# Altium schematic sheet 04 MAIN POWER.SchDoc
size A2; ApprovedBy: DNP; CheckedBy: DNP; Author: DNP; CompanyName: Google LLC; DrawnBy: DNP; Organization: Google LLC; Address1: 1600 Amphitheatre Parkway; Address2: Mountain View, CA 94043; Address3: DNP; Address4: DNP; DocumentNumber: 4; SheetNumber: 4; SheetTotal: 17; VersionControl_RevNumber: DNP; IsUserConfigurable: DNP; Time: DNP; ImagePath: DNP; Rule: DNP; ProjectName: Enterprise; Application_BuildNumber: DNP
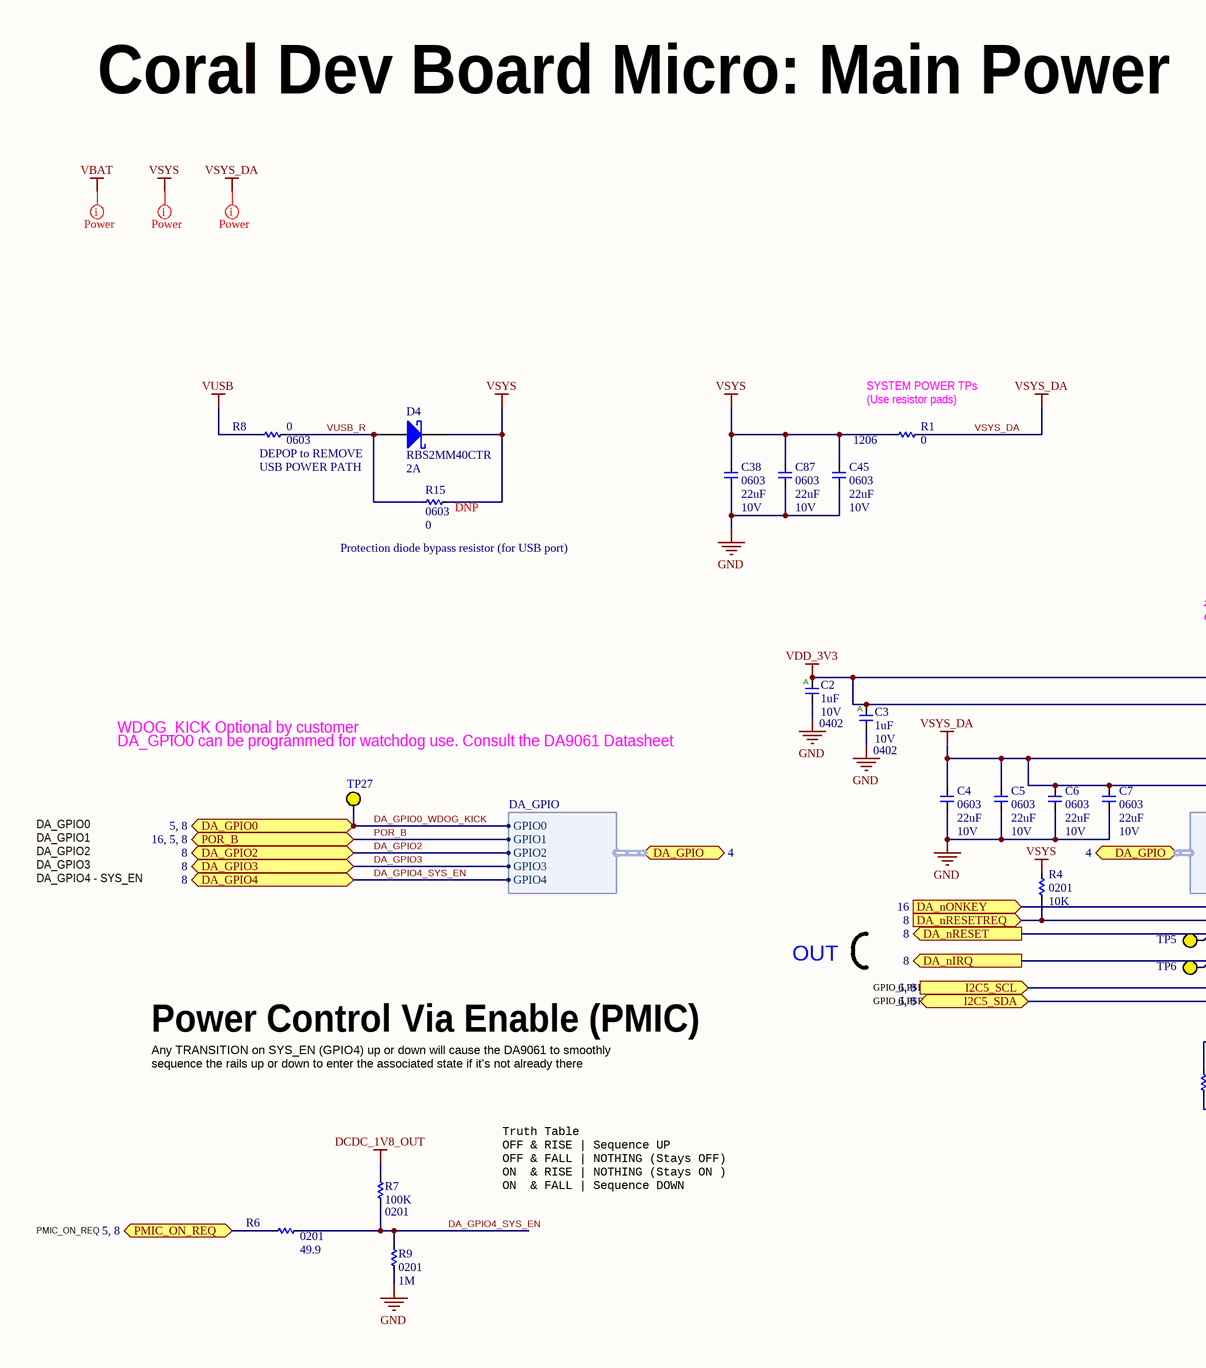
[diagram p0: 04 MAIN POWER.SchDoc, left]
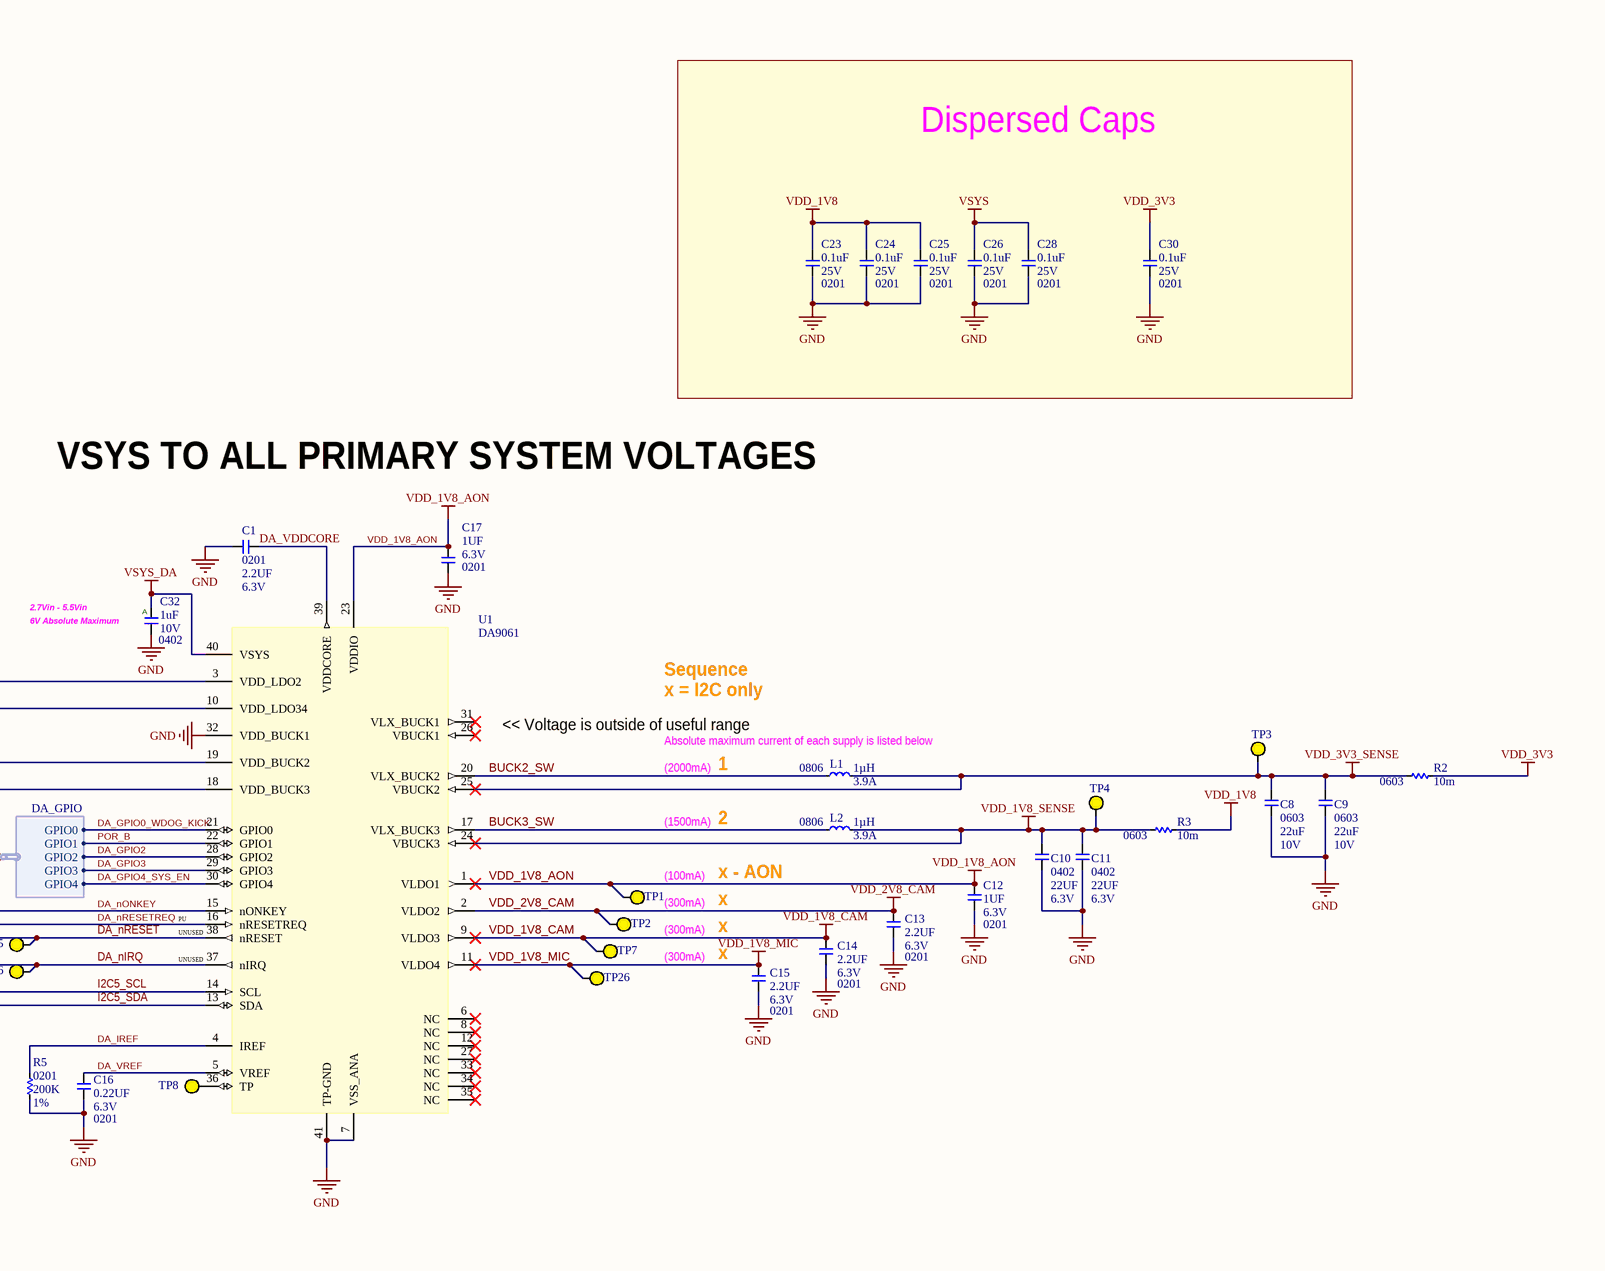
[diagram p1: 04 MAIN POWER.SchDoc, right]

## Parts
C1  value 2.2UF  Package: 0201  Voltage: 6.3V  [C0201_H0.39MM]  (hidden comment: __Template_Cap)
C2  value 1uF  Package: 0402  Voltage: 10V  [C0402]  (hidden comment: __Template_Cap_Auto)
C3  value 1uF  Package: 0402  Voltage: 10V  [C0402]  (hidden comment: __Template_Cap_Auto)
C4  value 22uF  Package: 0603  Voltage: 10V  [C0603]  (hidden comment: __Template_Cap)
C5  value 22uF  Package: 0603  Voltage: 10V  [C0603]  (hidden comment: __Template_Cap)
C6  value 22uF  Package: 0603  Voltage: 10V  [C0603]  (hidden comment: __Template_Cap)
C7  value 22uF  Package: 0603  Voltage: 10V  [C0603]  (hidden comment: __Template_Cap)
C8  value 22uF  Package: 0603  Voltage: 10V  [C0603]  (hidden comment: __Template_Cap)
C9  value 22uF  Package: 0603  Voltage: 10V  [C0603]  (hidden comment: __Template_Cap)
C10  value 22UF  Package: 0402  Voltage: 6.3V  [C0402]  (hidden comment: __Template_Cap)
C11  value 22UF  Package: 0402  Voltage: 6.3V  [C0402]  (hidden comment: __Template_Cap)
C12  value 1UF  Package: 0201  Voltage: 6.3V  [C0201_H0.39MM]  (hidden comment: __Template_Cap)
C13  value 2.2UF  Package: 0201  Voltage: 6.3V  [C0201_H0.39MM]  (hidden comment: __Template_Cap)
C14  value 2.2UF  Package: 0201  Voltage: 6.3V  [C0201_H0.39MM]  (hidden comment: __Template_Cap)
C15  value 2.2UF  Package: 0201  Voltage: 6.3V  [C0201_H0.39MM]  (hidden comment: __Template_Cap)
C16  value 0.22UF  Package: 0201  Voltage: 6.3V  [C0201]  (hidden comment: __Template_Cap)
C17  value 1UF  Package: 0201  Voltage: 6.3V  [C0201_H0.39MM]  (hidden comment: __Template_Cap)
C23  value 0.1uF  Package: 0201  Voltage: 25V  [C0201Y]  (hidden comment: __Template_Cap)
C24  value 0.1uF  Package: 0201  Voltage: 25V  [C0201Y]  (hidden comment: __Template_Cap)
C25  value 0.1uF  Package: 0201  Voltage: 25V  [C0201Y]  (hidden comment: __Template_Cap)
C26  value 0.1uF  Package: 0201  Voltage: 25V  [C0201Y]  (hidden comment: __Template_Cap)
C28  value 0.1uF  Package: 0201  Voltage: 25V  [C0201Y]  (hidden comment: __Template_Cap)
C30  value 0.1uF  Package: 0201  Voltage: 25V  [C0201Y]  (hidden comment: __Template_Cap)
C32  value 1uF  Package: 0402  Voltage: 10V  [C0402]  (hidden comment: __Template_Cap_Auto)
C38  value 22uF  Package: 0603  Voltage: 10V  [C0603]  (hidden comment: __Template_Cap)
C45  value 22uF  Package: 0603  Voltage: 10V  [C0603]  (hidden comment: __Template_Cap)
C87  value 22uF  Package: 0603  Voltage: 10V  [C0603]  (hidden comment: __Template_Cap)
D4  value RBS2MM40CTR  Current - Average Rectified (IO): 2A  [SOD123_AK]  (hidden comment: __Template_DIODE_SCHOTTKY)
L1  value 1µH  Package: 0806  Isat: 3.9A  [L2016_H1.0MM]  (hidden comment: __Template_Inductor)
L2  value 1µH  Package: 0806  Isat: 3.9A  [L2016_H1.0MM]  (hidden comment: __Template_Inductor)
R1  value 0  Package: 1206  [R1206]
R2  value 10m  Package: 0603  [R0603]
R3  value 10m  Package: 0603  [R0603]
R4  value 10K  Package: 0201  [R0201]
R5  value 200K  Package: 0201  Tolerance: 1%  [R0201]
R6  value 49.9  Package: 0201  [R0201]
R7  value 100K  Package: 0201  [R0201]
R8  value 0  Package: 0603  [R0603]
R9  value 1M  Package: 0201  [R0201]
R15  value 0  Package: 0603  [R0603]
TP1  TESTPAD_30MIL  [TESTPAD_SMT_30MIL]  (value not drawn)  (no BOM)
TP2  TESTPAD_30MIL  [TESTPAD_SMT_30MIL]  (value not drawn)  (no BOM)
TP3  TESTPAD_30MIL  [TESTPAD_SMT_30MIL]  (value not drawn)  (no BOM)
TP4  TESTPAD_30MIL  [TESTPAD_SMT_30MIL]  (value not drawn)  (no BOM)
TP5  TESTPAD_30MIL  [TESTPAD_SMT_30MIL]  (value not drawn)  (no BOM)
TP6  TESTPAD_30MIL  [TESTPAD_SMT_30MIL]  (value not drawn)  (no BOM)
TP7  TESTPAD_30MIL  [TESTPAD_SMT_30MIL]  (value not drawn)  (no BOM)
TP8  TESTPAD_30MIL  [TESTPAD_SMT_30MIL]  (value not drawn)  (no BOM)
TP26  TESTPAD_30MIL  [TESTPAD_SMT_30MIL]  (value not drawn)  (no BOM)
TP27  TESTPAD_30MIL  [TESTPAD_SMT_30MIL]  (value not drawn)  (no BOM)
U1  MFG P/N: DA9061  [QFN50P600X600X90-40-TP]  (hidden comment: PMIC_DIALOG_SEMI_DA9061)

## Blocks framed on the sheet
Dispersed Caps: C23-C26 C28 C30

## Ports
DA_GPIO0 (bidir, see 5, 8), DA_GPIO2 (bidir, see 8), DA_GPIO3 (bidir, see 8), DA_GPIO4 (bidir, see 8), DA_GPIO (bidir, harness DA_GPIO, see 4), DA_nIRQ (out, see 8), DA_nONKEY (in, see 16), DA_nRESET (out, see 8), DA_nRESETREQ (in, see 8), I2C5_SCL (in, see 6, 8), I2C5_SDA (bidir, see 6, 8), PMIC_ON_REQ (bidir, see 5, 8), POR_B (bidir, see 16, 5, 8)

## Harnesses
DA_GPIO: GPIO0, GPIO1, GPIO2, GPIO3, GPIO4

## Nets
DCDC_1V8_OUT: R7.2
GND: C1.1 C2.2 C3.2 C4.2 C5.2 C6.2 C7.2 C8.2 C9.2 C10.2 C11.2 C12.2 C13.2 C14.2 C15.2 C16.2 C17.2 C23.2 C24.2 C25.2 C26.2 C28.2 C30.2 C32.2 C38.2 C45.2 C87.2 R5.1 R9.1 U1.7(VSS_ANA) U1.32(VDD_BUCK1) U1.41(TP-GND)
VDD_1V8: C23.1 C24.1 C25.1 R3.2
VDD_1V8_AON: C12.1 C17.1 TP1.1 U1.1(VLDO1) U1.23(VDDIO)
VDD_1V8_CAM: C14.1 TP7.1 U1.9(VLDO3)
VDD_1V8_MIC: C15.1 TP26.1 U1.11(VLDO4)
VDD_1V8_SENSE: C10.1 C11.1 L2.2 R3.1 TP4.1 U1.24(VBUCK3)
VDD_2V8_CAM: C13.1 TP2.1 U1.2(VLDO2)
VDD_3V3: C2.1 C3.1 C30.1 R2.2 U1.3(VDD_LDO2) U1.10(VDD_LDO34)
VDD_3V3_SENSE: C8.1 C9.1 L1.2 R2.1 TP3.1 U1.25(VBUCK2)
VSYS: C26.1 C28.1 C38.1 C45.1 C87.1 D4.K R1.1 R4.2 R15.1
VSYS_DA: C4.1 C5.1 C6.1 C7.1 C32.1 R1.2 U1.18(VDD_BUCK3) U1.19(VDD_BUCK2) U1.40(VSYS)
VUSB: R8.2
BUCK2_SW: L1.1 U1.20(VLX_BUCK2)
BUCK3_SW: L2.1 U1.17(VLX_BUCK3)
DA_GPIO0_WDOG_KICK: TP27.1 U1.21(GPIO0) ; port DA_GPIO0, port DA_GPIO.GPIO0
DA_GPIO2: U1.28(GPIO2) ; port DA_GPIO2, port DA_GPIO.GPIO2
DA_GPIO3: U1.29(GPIO3) ; port DA_GPIO3, port DA_GPIO.GPIO3
DA_GPIO4_SYS_EN: R6.2 R7.1 R9.2 U1.30(GPIO4) ; port DA_GPIO4, port DA_GPIO.GPIO4
DA_IREF: R5.2 U1.4(IREF)
DA_nIRQ: TP6.1 U1.37(nIRQ) ; port DA_nIRQ
DA_nONKEY: U1.15(nONKEY) ; port DA_nONKEY
DA_nRESET: TP5.1 U1.38(nRESET) ; port DA_nRESET
DA_nRESETREQ: R4.1 U1.16(nRESETREQ) ; port DA_nRESETREQ
DA_VDDCORE: C1.2 U1.39(VDDCORE)
DA_VREF: C16.1 U1.5(VREF)
I2C5_SCL: U1.14(SCL) ; port I2C5_SCL
I2C5_SDA: U1.13(SDA) ; port I2C5_SDA
PMIC_ON_REQ: R6.1 ; port PMIC_ON_REQ
POR_B: U1.22(GPIO1) ; port POR_B, port DA_GPIO.GPIO1
VUSB_R: D4.A R8.1 R15.2
NetTP8_1: TP8.1 U1.36(TP)

Not connected (* = marked no-connect by the designer): U1 6(NC)* 8(NC)* 12(NC)* 26(VBUCK1)* 27(NC)* 31(VLX_BUCK1)* 33(NC)* 34(NC)* 35(NC)*

## Layout directives
net class Power: VBAT, VSYS, VSYS_DA

## Notes on the sheet
- Coral Dev Board Micro: Main Power
- (near R1) SYSTEM POWER TPs
- (near R8) DEPOP to REMOVE
- (near R1) (Use resistor pads)
- (near R8) USB POWER PATH
- VSYS TO ALL PRIMARY SYSTEM VOLTAGES
- (near R15) Protection diode bypass resistor (for USB port)
- 2.7Vin - 5.5Vin
- (near C32) 6V Absolute Maximum
- WDOG_KICK Optional by customer
- << Voltage is outside of useful range
- Sequence
- x = I2C only
- DA_GPIO0 can be programmed for watchdog use. Consult the DA9061 Datasheet
- (2000mA)
- (near L1) Absolute maximum current of each supply is listed below
- 1
- DA_GPIO2
- DA_GPIO3
- DA_GPIO1
- DA_GPIO0
- (1500mA)
- 2
- DA_GPIO4 - SYS_EN
- (near U1) PU
- (near U1) UNUSED
- (near TP1) (100mA)
- (300mA)
- x - AON
- x
- (near C15) x
- OUT
- GPIO_LPSR_04
- GPIO_LPSR_05
- Power Control Via Enable (PMIC)
- Any TRANSITION on SYS_EN (GPIO4) up or down will cause the DA9061 to smoothly sequence the rails up or down to enter the associated state if it's not already there
- Truth Table
  OFF & RISE | Sequence UP
  OFF & FALL | NOTHING (Stays OFF)
  ON  & RISE | NOTHING (Stays ON )
  ON  & FALL | Sequence DOWN
- PMIC_ON_REQ
- Labels drawn without touching a wire or pin: VBAT, VSYS, VSYS_DA
- Project:
- Engineer:
- Date:
- File:
- Revision:
- Sheet
- of
- (in symbol 26) A

## Library data of the parts
C1 C13-C15 = 1761: CAP, CER, X5R, 2.2uF, 20%, 6.3V, 0201, 0.39mm; ID: 1761; MFG: YAGEO; MFG P/N: CC0201MRX5R5BB225; EPIC: G150-01316-00; Status: In Development; Dielectric: X5R; Tolerance: 20%; Height: 0.39mm; Supplier 1: Digi-Key; HelpURL: https://www.digikey.com/product-detail/en/yageo/CC0201MRX5R5BB225/311-3473-1-ND/7164494; ComponentLink1Description: Datasheet; ComponentLink1URL: http://www.yageo.com/documents/recent/UPY-GPHC_X5R_4V-to-50V_25.pdf; Supplier Part Number 1: 311-3473-1-ND
C2 C3 C32 = 26: CAP, CER, X5R, 1uF, 10V, 10%, 0402, AUTOGRADE; ID: 26; MFG: Taiyo Yuden; MFG P/N: LMK105BJ105KVHF; XPN: 150-01126-00; PROXY: Use ID #574; Gecko: 150-04432-00; Status: Released; Dielectric: X5R; Tolerance: 10%; Height: 0.55mm; Supplier 1: Digi-Key; ComponentLink1Description: Datasheet; COMMON: 150-01126-00; Supplier Part Number 1: 587-3712-1-ND
C4-C9 C38 C45 C87 = 108: CAP, CER, X5R, 22uF, 20%, 10V, 0603; ID: 108; MFG: TDK; MFG P/N: C1608X5R1A226M080AC; XPN: 150-00202-00; PROXY: Use ID #452; Status: Released; Dielectric: X5R; Tolerance: 20%; Height: 1mm; ComponentLink1Description: Datasheet; COMMON: 150-00202-00
C10 C11 = 1719: CAP, CER, X5R, 22uF, 20%, 6.3V, 0402; ID: 1719; MFG: AVX; MFG P/N: 04026D226MAT2A; XPN: 150-00420-00; PROXY: 150-03491-00; Status: Released; Dielectric: X5R; Tolerance: 20%; Height: 0.70mm; Supplier 1: Digi-Key; HelpURL: https://www.digikey.in/product-detail/en/avx-corporation/04026D226MAT2A/478-9839-1-ND/5964924; ComponentLink1Description: Datasheet; ComponentLink1URL: http://datasheets.avx.com/cx5r.pdf; COMMON: 150-00420-00; LOON: 150-00420-00; Gecko: 150-00420-00; Supplier Part Number 1: 478-9839-1-ND
C12 C17 = 1771: CAP, CER, X6S, 1uF, 20%, 6.3V, 0201, 0.39mm; ID: 1771; MFG: MURATA; MFG P/N: GRM033C80J105ME05D; EPIC: G150-02531-00; Status: In Development; Dielectric: X6S; Tolerance: 20%; Height: 0.39mm; Supplier 1: Digi-Key; HelpURL: https://www.digikey.com/product-detail/en/murata-electronics-north-america/GRM033C80J105ME05D/490-13218-1-ND/5877426; ComponentLink1Description: Datasheet; ComponentLink1URL: https://psearch.en.murata.com/capacitor/product/GRM033C80J105ME05%23.pdf; Supplier Part Number 1: 490-13218-1-ND
C16 = 983: CAP, CER, X5R, 0.22uF, 6.3V, 10%, 0201, 0.33mm T; ID: 983; MFG: TDK; MFG P/N: C0603X5R0J224K030BB; XPN: 150-00425-00; Status: NRND; Dielectric: X5R; Tolerance: 10%; Height: 0.33mm T; ComponentLink1Description: Datasheet; COMMON: 150-00425-00
C23-C26 C28 C30 = 386: CAP, CER, X5R, 0.1uF, 25V, 20%, 0201, 0.33mm T; ID: 386; MFG: MURATA; MFG P/N: GRM033R61E104ME14D; XPN: 150-01204-00; Status: Released; Dielectric: X5R; Tolerance: 20%; Height: 0.33mm T; ComponentLink1Description: Datasheet; COMMON: 150-01204-00; LOON: 150-01204-00; Gecko: 150-01204-00
D4 = 348: DIODE, SCHOTTKY, 20V VRRM, 2A IO, 45A SURGE, SOD-123F; ID: 348; MFG: Rohm Semiconductor; Voltage – Forward (VF) (MAX) @ IF: 390 mV @ 2 A; Current - Reverse Leakage @ VR: 600 µA @ 20 V; Status: Released; MFG P/N: RBS2MM40CTR; Package: SOD-123F; Category: DIODE; RoHS Compliant: Yes; Diode Type: Schottky; Mounting Type: SMD; Voltage - DC Reverse (VR) (MAX): 20V; Operating Temperature – Junction: 125°C; Supplier 1: Digi-Key; HelpURL: https://www.digikey.com/en/products/detail/rohm-semiconductor/RBS2MM40CTR/13547997?s=N4IgTCBcDaIEoCEDKYCyqAsAGAwgFThAF0BfIA; ComponentLink1Description: Datasheet; ComponentLink1URL: https://fscdn.rohm.com/en/products/databook/datasheet/discrete/diode/schottky_barrier/rbs2mm40ctr-e.pdf; Height: 0.9mm; Supplier Part Number 1: 846-RBS2MM40CTR-ND
L1 L2 = 881: IND, PWR, FILM, 1uH, 20%, 3.9A Isat, 3.1A Idc, 0.056 DCR, 2016m, 1.00mm; ID: 881; Catagory: Fixed Inductors; MFG: TDK; MFG P/N: TFM201610ALM-1R0MTAA; Tolerance: 20; L Test Freq: 1MHz; Rdc max: 56mOhm Max; EPIC: G180-01867-00; ComponentLink1Description: Datasheet; Status: In Development; Supplier 1: Digi-Key; HelpURL: https://www.digikey.com/product-detail/en/tdk-corporation/TFM201610ALM-1R0MTAA/445-174185-1-ND/5812325; ComponentLink1URL: https://product.tdk.com/info/en/catalog/datasheets/inductor_commercial_power_tfm201610alm_en.pdf; Supplier Part Number 1: 445-174185-1-ND
R1 = 5: RES, 0, 5%, 1/4W, 1206; ID: 5; MFG: ROHM; MFG P/N: MCR18EZHJ000; COMMON: 470-03592-00; PROXY: 470-16245-00; XPN: XS-10014547; Status: NRND; Power: 1/4W; Tolerance: 5%; Height: 0.65mm; Supplier 1: Digi-Key; LOON: 470-03592-00; Gecko: 470-03592-00; Supplier Part Number 1: RHM0.0ECT-ND
R2 R3 = 191: Resistor, 10.0m Ohms, 0603, 0.1W, ±1%; ID: 191; MFG: VISHAY; MFG P/N: WSL0603R0100FEA; Power: 1/10W; COMMON: 470-00380-00; Status: Released; Tolerance: 1%; Height: 0.46mm; Supplier 1: Digi-Key; LOON: 470-00380-00; Gecko: 470-00380-00; XPN: 470-00380-00; Supplier Part Number 1: WSLJ-.01CT-ND
R4 = 4151: RES, 10K, 1%, 1/20W, 0201; ID: 4151; MFG: YAGEO; MFG P/N: RC0201FR-0710KL; COMMON: 470-00033-00; PROXY: 470-16076-00; Status: Released; Power: 1/20W; Tolerance: 1%; Height: 0.26mm; Supplier 1: Digi-Key; LOON: 470-00033-00; Gecko: 470-00033-00; XPN: 470-00033-00; Supplier Part Number 1: 311-10.0KMCT-ND
R5 = 5211: Resistor, 200K Ohms, 0201, 0.05W, ±1%; ID: 5211; MFG: VISHAY; MFG P/N: CRCW0201200KFKED; Power: 1/20W; COMMON: 470-00808-00; Status: Released; Height: 0.28mm; Supplier 1: Digi-Key; LOON: 470-00808-00; Gecko: 470-00808-00; XPN: 470-00808-00; Supplier Part Number 1: 541-200KAABCT-ND
R6 = 2114: RES, 49.9, 1%, 1/20W, 0201; ID: 2114; MFG: PANASONIC; MFG P/N: ERJ-1GEF49R9C; COMMON: 470-00007-00; PROXY: Alt ID #6310; Status: NRND; Power: 1/20W; Tolerance: 1%; Height: 0.26mm; Supplier 1: Digi-Key; XPN: 470-00007-00; Supplier Part Number 1: P49.9ABCT-ND
R7 = 7818: RES, 100K, 1%, 1/20W, 0201; ID: 7818; MFG: PANASONIC; MFG P/N: ERJ1GEF1003C; COMMON: 470-00506-00; Status: NRND; Power: 1/20W; Tolerance: 1%; LOON: 470-00506-00; Gecko: 470-00506-00; XPN: 470-00506-00
R8 R15 = 6701: RES, 0, JUMPER, 1/8W, 0603; ID: 6701; MFG: VISHAY; MFG P/N: MCT06030Z0000ZP500; COMMON: 470-02384-00; PROXY: 470-16006-00; Gecko: 470-17718-00; Status: Released; Power: 1/8W; Tolerance: JUMPER; LOON: 470-02384-00; XPN: 470-02384-00
  R15: DNP: DNP
R9 = 7806: RES, 1M, 1%, 1/20W, 0201; ID: 7806; MFG: PANASONIC; MFG P/N: ERJ1GEF1004C; COMMON: 470-00029-00; Status: NRND; Power: 1/20W; Tolerance: 1%; LOON: 470-00029-00; Gecko: 470-00029-00; XPN: 470-00029-00
TP1-TP8 TP26 TP27 = 178: TESTPAD_SMT_30MIL; ID: 178; MFG: _PCB Feature; Status: Released; ComponentLink1URL: _PCB Feature
U1 = 770: IC, PWR MANAGEMENT, DA9061, DDR, BUCK, LDO, 2.7 TO 5.5 VIN, SMD; ID: 770; MFG: Dialog Semiconductor; Status: Released; Package: 40-QFN; Category: Integrated Circuits (ICs); RoHS Compliant: Yes; ComponentLink1URL: https://drive.google.com/a/google.com/file/d/1gaatOYX1-uBj1SMvDyL_BcuT9Czf3Mnn/view?usp=sharing; Mounting Type: SMD; Height: 0.9mm